# Altium project Digital_Watch.PrjPcb
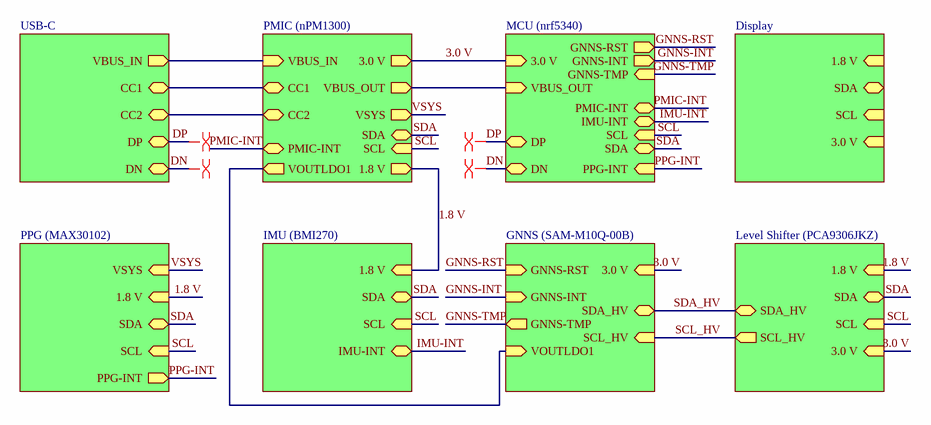
[diagram p0: Digital_Watch.SchDoc]
8 sheets, 72 parts. Net scope: hierarchical (ports join the sheet entries above them; power ports are global).
Board file: Digital_Watch.PcbDoc
Sheets:
  Digital_Watch.SchDoc
    Designator = MCU (nrf5340).SchDoc
    Designator = PMIC (nPM1300).SchDoc
    Designator = USB-C.SchDoc
    Designator = IMU (BMI270).SchDoc
    Designator = GNNS (SAM-M10Q-00B).SchDoc
    Designator = PPG (MAX30102).SchDoc
    Designator = Level Shifter (PCA9306JKZ).SchDoc

## Sheet Digital_Watch.SchDoc
size A4; Revision: 1.0; SheetNumber: 1; SheetTotal: 9; DocumentSize: A4; RefLayoutTitle: Digital Watch

### Sub-sheets
Designator = MCU (nrf5340): 3.0 V (in), DP (bidir), DN (bidir), VBUS_OUT (in), GNNS-RST (out), GNNS-INT (out), GNNS-TMP (in), PPG-INT (in), SDA (bidir), SCL (in), IMU-INT (bidir), PMIC-INT (bidir)
Designator = PMIC (nPM1300): 3.0 V (out), VBUS_IN (in), CC1 (bidir), CC2 (bidir), VBUS_OUT (out), VSYS (out), VOUTLDO1 (out), 1.8 V (out), SCL (in), SDA (bidir), PMIC-INT (bidir)
Designator = USB-C: DN (bidir), DP (bidir), CC2 (bidir), CC1 (bidir), VBUS_IN (out)
Designator = IMU (BMI270): 1.8 V (in), SDA (bidir), SCL (in), IMU-INT (bidir)
Designator = GNNS (SAM-M10Q-00B): 3.0 V (in), GNNS-RST (in), GNNS-INT (in), GNNS-TMP (out), VOUTLDO1 (in), SDA_HV (bidir), SCL_HV (in)
Designator = PPG (MAX30102): VSYS (in), SCL (in), 1.8 V (in), SDA (bidir), PPG-INT (out)
Designator = Level Shifter (PCA9306JKZ): 1.8 V (in), 3.0 V (in), SCL_HV (out), SDA_HV (bidir), SDA (bidir), SCL (in)
Designator = Display (file not in this document): 1.8 V (in), 3.0 V (in), SDA (bidir), SCL (in)

### Nets
1.8 V: sheet Designator/1.8 V, sheet Designator/1.8 V, sheet Designator/1.8 V, sheet Designator/1.8 V
3.0 V: sheet Designator/3.0 V, sheet Designator/3.0 V, sheet Designator/3.0 V, sheet Designator/3.0 V
CC1: sheet Designator/CC1, sheet Designator/CC1
CC2: sheet Designator/CC2, sheet Designator/CC2
DN: sheet Designator/DN, sheet Designator/DN  [project net D_N]
DP: sheet Designator/DP, sheet Designator/DP  [project net D_P]
GNNS-INT: sheet Designator/GNNS-INT, sheet Designator/GNNS-INT
GNNS-RST: sheet Designator/GNNS-RST, sheet Designator/GNNS-RST
GNNS-TMP: sheet Designator/GNNS-TMP, sheet Designator/GNNS-TMP
IMU-INT: sheet Designator/IMU-INT, sheet Designator/IMU-INT
PMIC-INT: sheet Designator/PMIC-INT, sheet Designator/PMIC-INT  [project net GPIO4]
PPG-INT: sheet Designator/PPG-INT, sheet Designator/PPG-INT  [project net P0.22]
SCL: sheet Designator/SCL, sheet Designator/SCL, sheet Designator/SCL, sheet Designator/SCL, sheet Designator/SCL  [project net P1.03/TWI]
SCL_HV: sheet Designator/SCL_HV, sheet Designator/SCL_HV
SDA: sheet Designator/SDA, sheet Designator/SDA, sheet Designator/SDA, sheet Designator/SDA, sheet Designator/SDA  [project net P1.02/TWI]
SDA_HV: sheet Designator/SDA_HV, sheet Designator/SDA_HV
VBUS_OUT: sheet Designator/VBUS_OUT, sheet Designator/VBUS_OUT
VOUTLDO1: sheet Designator/VOUTLDO1, sheet Designator/VOUTLDO1
VSYS: sheet Designator/VSYS, sheet Designator/VSYS
NetC001_1: sheet Designator/VBUS_IN, sheet Designator/VBUS_IN

### Layout directives
differential pair: D_N, D_P

### Notes on the sheet
- Title
- Size
- Date:
- A4
- Device
- Sheet         of
- Revision
- File:
- Drawn By:

## Sheet MCU (nrf5340).SchDoc
size A3; BoardTitle: nRF5340-QKAA Reference Layout - Config 1; DocumentNumber: 1; Revision: 1.2; SheetNumber: 3; SheetTotal: 9; DocumentSize: A3; RefLayoutTitle: Reference Layout Config. 1: VDDH supply, DCDC, USB; Device: nRF5340-QKAA; Classification: PUBLIC; ProjectName: Digital_Watch.PrjPcb
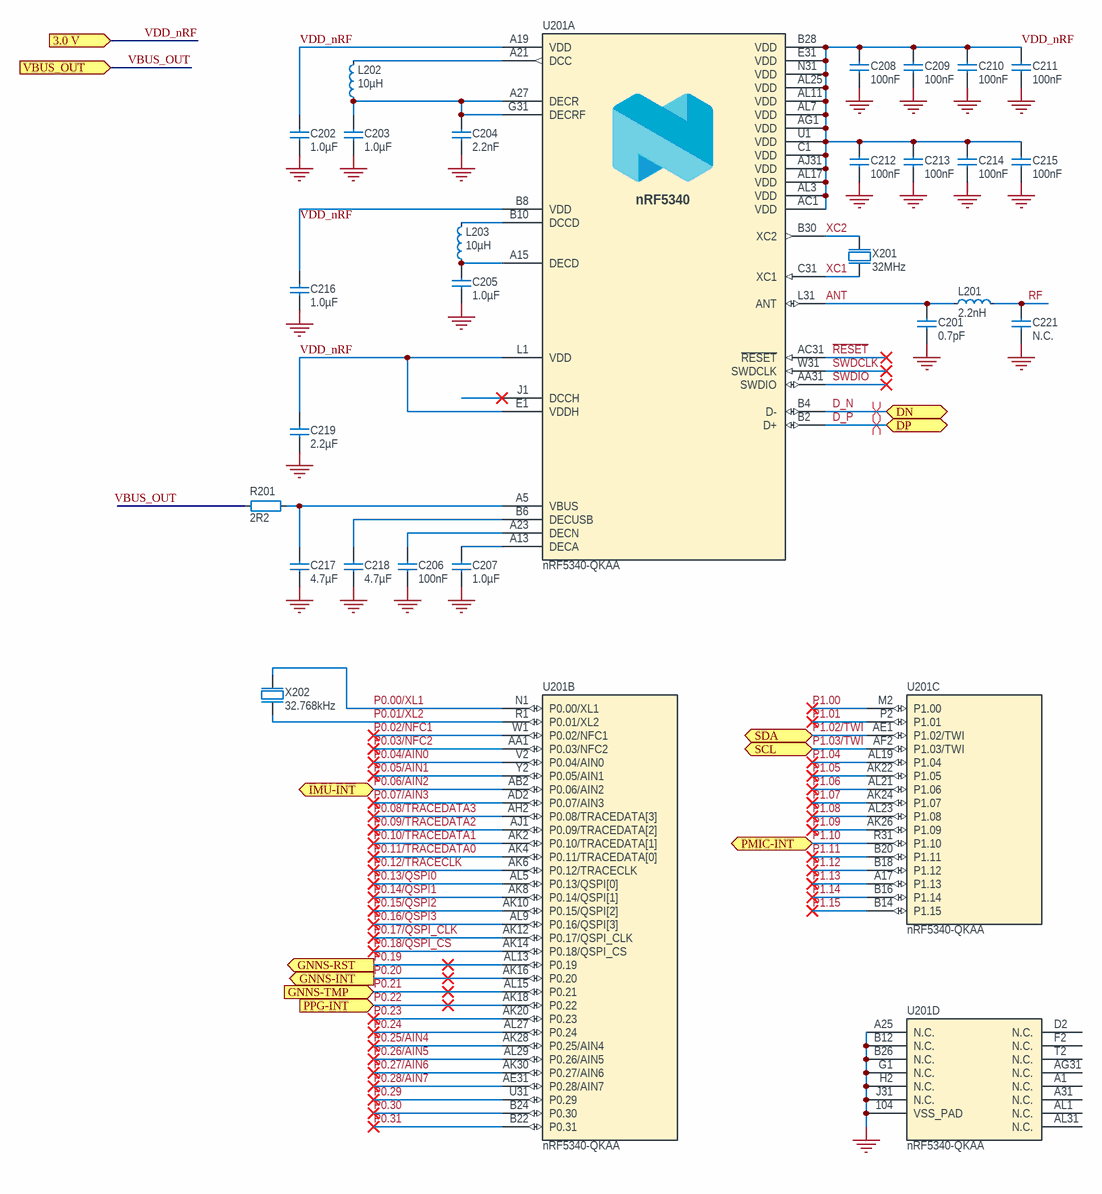
[diagram p1: MCU (nrf5340).SchDoc]

### Parts
C201  0.7pF  [CAPC0603X03L_C]
C202  1.0µF  [CAPC1005X04L]
C203  1.0µF  [CAPC1005X04L]
C204  2.2nF  [CAPC0603X03L_C]
C205  1.0µF  [CAPC1005X04L]
C206  100nF  [CAPC0603X03L_C]
C207  1.0µF  [CAPC1005X04L]
C208  100nF  [CAPC0603X03L_C]
C209  100nF  [CAPC0603X03L_C]
C210  100nF  [CAPC0603X03L_C]
C211  100nF  [CAPC0603X03L_C]
C212  100nF  [CAPC0603X03L_C]
C213  100nF  [CAPC0603X03L_C]
C214  100nF  [CAPC0603X03L_C]
C215  100nF  [CAPC0603X03L_C]
C216  1.0µF  [CAPC1005X04L]
C217  4.7µF  [CAPC1608X06L]
C218  4.7µF  [CAPC1608X06L]
C219  2.2µF  [CAPC1608X06L]
C221  N.C.  [CAPC0603X03L_C_NC]
L201  2.2nH  [INDC0603X03L_C]
L202  10µH  [INDC1608X06L]
L203  10µH  [INDC1608X06L]
R201  2R2  [RESC0603X03L_C]
U201  nRF5340-QKAA  [AQFN40P700X700X85_HS-99N]  (parts A,B,C,D of 4)
X201  32MHz  [BT-XTAL_2016]
X202  32.768kHz  [XTAL_2012]

### Ports
3.0 V (in, see Digital_Watch[2B], GNNS (SAM-M10Q-00B)[1A], Level Shifter (PCA9306JKZ)[2B], PMIC (nPM1300)[3B]), DN (bidir, see Digital_Watch[2B], USB-C[1B]), DP (bidir, see Digital_Watch[2B], USB-C[1B]), GNNS-INT (out, see Digital_Watch[3B], GNNS (SAM-M10Q-00B)[1A]), GNNS-RST (out, see Digital_Watch[3B], GNNS (SAM-M10Q-00B)[1A]), GNNS-TMP (in, see Digital_Watch[3B], GNNS (SAM-M10Q-00B)[1B]), IMU-INT (bidir, see Digital_Watch[3B], IMU (BMI270)[1B]), PMIC-INT (bidir, see Digital_Watch[3B], PMIC (nPM1300)[2B]), PPG-INT (in, see Digital_Watch[3B], PPG (MAX30102)[1A]), SCL (bidir, see Digital_Watch[3B], IMU (BMI270)[1A], Level Shifter (PCA9306JKZ)[2B], PMIC (nPM1300)[2C], PPG (MAX30102)[1A]), SDA (bidir, see Digital_Watch[3B], IMU (BMI270)[1B], Level Shifter (PCA9306JKZ)[2B], PMIC (nPM1300)[2C], PPG (MAX30102)[1A]), VBUS_OUT (in, see Digital_Watch[2B], PMIC (nPM1300)[4A])

### Nets
GND: C201.1 C202.2 C203.1 C204.2 C205.1 C206.2 C207.1 C208.2 C209.2 C210.2 C211.2 C212.2 C213.2 C214.2 C215.2 C216.1 C217.2 C218.2 C219.2 C221.1 U201.104(VSS_PAD) U201.A25(N.C.) U201.B12(N.C.) U201.B26(N.C.) U201.G1(N.C.) U201.H2(N.C.) U201.J31(N.C.) X201.2(GND) X201.4(GND)
ANT: C201.2 L201.2 U201.L31(ANT)
D_N: U201.B4(D-) ; port DN
D_P: U201.B2(D+) ; port DP
P0.00/XL1: U201.N1(P0.00/XL1) X202.1(inp)
P0.01/XL2: U201.R1(P0.01/XL2) X202.2(out)
P0.02/NFC1: U201.W1(P0.02/NFC1)
P0.03/NFC2: U201.AA1(P0.03/NFC2)
P0.04/AIN0: U201.V2(P0.04/AIN0)
P0.05/AIN1: U201.Y2(P0.05/AIN1)
P0.06/AIN2: U201.AB2(P0.06/AIN2) ; port IMU-INT  [project net IMU-INT]
P0.07/AIN3: U201.AD2(P0.07/AIN3)
P0.08/TRACEDATA3: U201.AH2(P0.08/TRACEDATA[3])
P0.09/TRACEDATA2: U201.AJ1(P0.09/TRACEDATA[2])
P0.10/TRACEDATA1: U201.AK2(P0.10/TRACEDATA[1])
P0.11/TRACEDATA0: U201.AK4(P0.11/TRACEDATA[0])
P0.12/TRACECLK: U201.AK6(P0.12/TRACECLK)
P0.13/QSPI0: U201.AL5(P0.13/QSPI[0])
P0.14/QSPI1: U201.AK8(P0.14/QSPI[1])
P0.15/QSPI2: U201.AK10(P0.15/QSPI[2])
P0.16/QSPI3: U201.AL9(P0.16/QSPI[3])
P0.17/QSPI_CLK: U201.AK12(P0.17/QSPI_CLK)
P0.18/QSPI_CS: U201.AK14(P0.18/QSPI_CS)
P0.19: U201.AL13(P0.19) ; port GNNS-RST  [project net GNNS-RST]
P0.20: U201.AK16(P0.20) ; port GNNS-INT  [project net GNNS-INT]
P0.21: U201.AL15(P0.21) ; port GNNS-TMP  [project net GNNS-TMP]
P0.22: U201.AK18(P0.22) ; port PPG-INT
P0.23: U201.AK20(P0.23)
P0.24: U201.AL27(P0.24)
P0.25/AIN4: U201.AK28(P0.25/AIN4)
P0.26/AIN5: U201.AL29(P0.26/AIN5)
P0.27/AIN6: U201.AK30(P0.27/AIN6)
P0.28/AIN7: U201.AE31(P0.28/AIN7)
P0.29: U201.U31(P0.29)
P0.30: U201.B24(P0.30)
P0.31: U201.B22(P0.31)
P1.00: U201.M2(P1.00)
P1.01: U201.P2(P1.01)
P1.02/TWI: U201.AE1(P1.02/TWI) ; port SDA
P1.03/TWI: U201.AF2(P1.03/TWI) ; port SCL
P1.04: U201.AL19(P1.04)
P1.05: U201.AK22(P1.05)
P1.06: U201.AL21(P1.06)
P1.07: U201.AK24(P1.07)
P1.08: U201.AL23(P1.08)
P1.09: U201.AK26(P1.09)
P1.10: U201.R31(P1.10) ; port PMIC-INT  [project net GPIO4]
P1.11: U201.B20(P1.11)
P1.12: U201.B18(P1.12)
P1.13: U201.A17(P1.13)
P1.14: U201.B16(P1.14)
P1.15: U201.B14(P1.15)
~{RESET}: U201.AC31(~{RESET})
RF: C221.2 L201.1
SWDCLK: U201.W31(SWDCLK)
SWDIO: U201.AA31(SWDIO)
VBUS_OUT: R201.1 ; port VBUS_OUT
VDD_nRF: C202.1 C208.1 C209.1 C210.1 C211.1 C212.1 C213.1 C214.1 C215.1 C216.2 C219.1 U201.A19(VDD) U201.AC1(VDD) U201.AG1(VDD) U201.AJ31(VDD) U201.AL3(VDD) U201.AL7(VDD) U201.AL11(VDD) U201.AL17(VDD) U201.AL25(VDD) U201.B8(VDD) U201.B28(VDD) U201.C1(VDD) U201.E1(VDDH) U201.E31(VDD) U201.L1(VDD) U201.N31(VDD) U201.U1(VDD) ; port 3.0 V  [project net 3.0 V]
XC1: U201.C31(XC1) X201.1(inp)
XC2: U201.B30(XC2) X201.3(out)
NetC203_2: C203.2 C204.1 L202.1 U201.A27(DECR) U201.G31(DECRF)
NetC205_2: C205.2 L203.1 U201.A15(DECD)
NetC206_1: C206.1 U201.A23(DECN)
NetC207_2: C207.2 U201.A13(DECA)
NetC217_1: C217.1 R201.2 U201.A5(VBUS)
NetC218_1: C218.1 U201.B6(DECUSB)
NetL202_2: L202.2 U201.A21(DCC)
NetL203_2: L203.2 U201.B10(DCCD)

Not connected (* = marked no-connect by the designer): U201 A1(N.C.) A31(N.C.) AG31(N.C.) AL1(N.C.) AL31(N.C.) D2(N.C.) F2(N.C.) J1(DCCH)* T2(N.C.)

### Layout directives
differential pair: D_N, D_P

### Notes on the sheet
- Title
- Size
- Date:
- File:
- A3
- Device
- Sheet         of
- Drawn By:
- Revision
- Classification:
- (in symbol nRF5340-QKAA, part A) nRF5340

### Library data of the parts
C201 = C0201-0.7p: Capacitor, NP0, ±0.05pF; Pad Count: 2; Value: 0.7pF; Footprint Doc: 0201; Component Class: Capacitors
C202 C203 C205 C207 C216 = C0402-1µ0-10V-X7S-GRM155C71A105KE11: Capacitor, X7S, ±10%; Pad Count: 2; Value: 1.0µF; Footprint Doc: 0402; Component Class: Capacitors
  C202: Author: prbu
C204 = C0201-2n2: Capacitor, X7R, ±10%; Pad Count: 2; Value: 2.2nF; Footprint Doc: 0201; Component Class: Capacitors
C206 C208-C215 = C0201-100n-16V-X7S: Capacitor, X7S, ±10%; Pad Count: 2; Value: 100nF; Footprint Doc: 0201; Component Class: Capacitors
C217 = C0603-4µ7-10V-X7S: Capacitor, X7S, ±10%; Pad Count: 2; Value: 4.7µF; Footprint Doc: 0603; Component Class: Capacitors
C218 = C0603-4µ7-6.3V-X7R: Capacitor, X7R, ±10%; Pad Count: 2; Value: 4.7µF; Footprint Doc: 0603; Component Class: Capacitors
C219 = C0603-2µ2-6.3V-X7R: Capacitor, X7R, ±10%; Pad Count: 2; Value: 2.2µF; Footprint Doc: 0603; Component Class: Capacitors
C221 = C0201-N.C.: Not mounted; Assembly: Not mounted; Pad Count: 2; Value: N.C.; Footprint Doc: 0201; Component Class: Capacitors
L201 = L0201-2n2: High frequency chip inductor, ±5%; Pad Count: 2; Footprint Doc: 0201; Value: 2.2nH; Component Class: Inductors
L202 L203 = L0603-10µ: Chip Inductor, IDC,min = 50 mA, ±20%; Pad Count: 2; Value: 10µH; Footprint Doc: 0603; Component Class: Inductors
R201 = R0201: Resistor, ±1%, 0.05W; Pad Count: 2; Footprint Doc: 0201; Value: 2R2; Component Class: Resistors; Author: rsk
U201 = nRF5340-QKAA: Multi-protocol Bluetooth Low Energy, IEEE 802.15.4, ANT and 2.4GHz proprietary system-on-chip; Pad Count: 98; Footprint Doc: AQFN-98; Value: nRF5340-QKAA; Component Class: nRF_Devices
X201 = XTAL_SMD2016_32MHz_8pF_General: XTAL SMD 2016, 32MHz, Cl=8pF, Total Tol: ±30ppm; Pad Count: 4; Value: 32MHz; Footprint Doc: XTAL_2016; Component Class: Oscillators
X202 = XTAL_SMD2012_32.768kHz_9pF_General: XTAL SMD 2012, 32.768kHz, Cl=9pF, Total Tol: ±50ppm; Pad Count: 2; Value: 32.768kHz; Footprint Doc: XTAL_2012; Component Class: Oscillators

## Sheet PMIC (nPM1300).SchDoc: nPM1300-QEAA Ref. Layout Config. 1
size A4; Revision: 1.2; SheetNumber: 2; SheetTotal: 9; DocumentSize: A4; BoardTitle: nPM1300-QEAA Ref. Layout Config. 1; PCAName: nPM1300-QEAA; RefLayoutTitle: PMIC; Device: nPM1300-QEAA; Config: 1
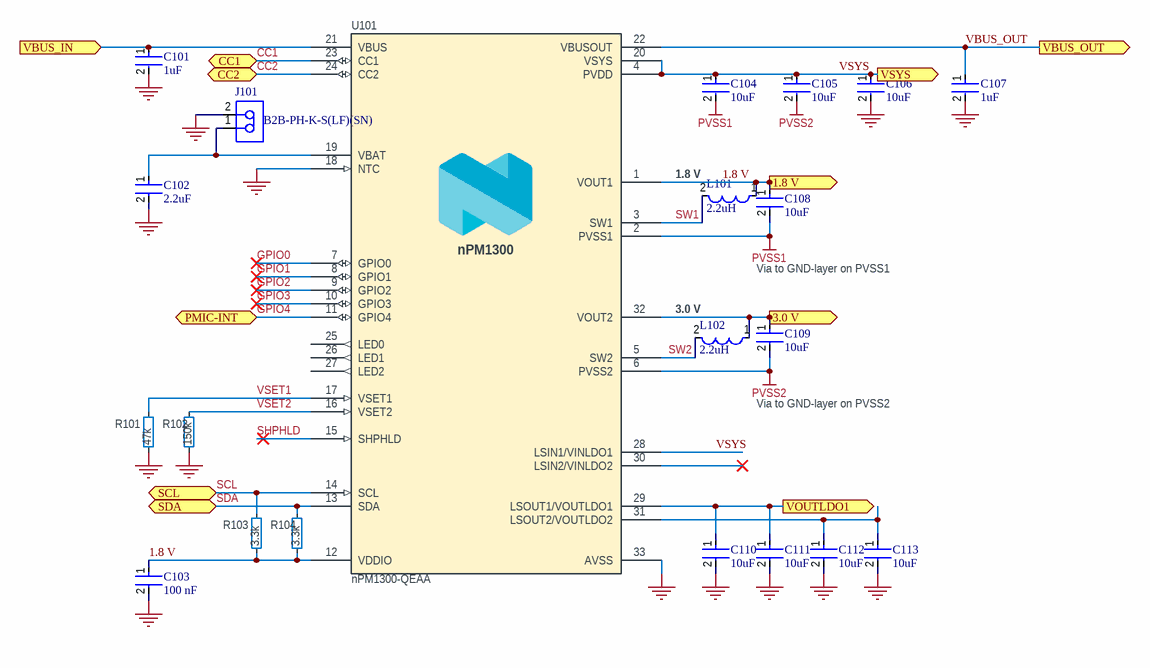
[diagram p2: PMIC (nPM1300).SchDoc]

### Parts
C101  1uF  [FP-CL10-IPC_C]
C102  2.2uF  [FP-GRM188-0_2-MFG]
C103  100 nF  [FP-CC0201-BA-MFG]
C104  10uF  [FP-GRM188-0_2-MFG]
C105  10uF  [FP-GRM188-0_2-MFG]
C106  10uF  [FP-GRM188-0_2-MFG]
C107  1uF  [FP-CL10-IPC_C]
C108  10uF  [FP-GRM188-0_2-MFG]
C109  10uF  [FP-GRM188-0_2-MFG]
C110  10uF  [FP-GRM188-0_2-MFG]
C111  10uF  [FP-GRM188-0_2-MFG]
C112  10uF  [FP-GRM188-0_2-MFG]
C113  10uF  [FP-GRM188-0_2-MFG]
J101  B2B-PH-K-S(LF)(SN)  [JST-B2B-PH-K-S_V]
L101  2.2uH  [FP-MLP2016M-IPC_B]
L102  2.2uH  [FP-MLP2016M-IPC_B]
R101  47k  [RESC0603X03L_C]
R102  150k  [RESC0603X03L_C]
R103  3.3k  [RESC0603X03L_C]
R104  3.3k  [RESC0603X03L_C]
U101  nPM1300-QEAA  [QFN32_5X5_NOR]

### Ports
1.8 V (out, see Digital_Watch[2B], IMU (BMI270)[1A], Level Shifter (PCA9306JKZ)[2B], PPG (MAX30102)[1A]), 3.0 V (out, see Digital_Watch[2B], GNNS (SAM-M10Q-00B)[1A], Level Shifter (PCA9306JKZ)[2B], MCU (nrf5340)[2A]), CC1 (bidir, see Digital_Watch[2B], USB-C[4B]), CC2 (bidir, see Digital_Watch[2B], USB-C[4B]), PMIC-INT (bidir, see Digital_Watch[2B], MCU (nrf5340)[4C]), SCL (bidir, see Digital_Watch[2B], IMU (BMI270)[1A], Level Shifter (PCA9306JKZ)[2B], MCU (nrf5340)[4C], PPG (MAX30102)[1A]), SDA (bidir, see Digital_Watch[2B], IMU (BMI270)[1B], Level Shifter (PCA9306JKZ)[2B], MCU (nrf5340)[4C], PPG (MAX30102)[1A]), VBUS_IN (in, see Digital_Watch[2B], USB-C[2B]), VBUS_OUT (out, see Digital_Watch[2B], MCU (nrf5340)[2A]), VOUTLDO1 (out, see Digital_Watch[2B], GNNS (SAM-M10Q-00B)[1B]), VSYS (out, see Digital_Watch[2B], PPG (MAX30102)[1B])

### Nets
GND: C101.2 C102.2 C103.2 C106.2 C107.2 C110.2 C111.2 C112.2 C113.2 J101.2 R101.2 R102.2 U101.18(NTC) U101.33(AVSS)
PVSS1: C104.2 C108.2 U101.2(PVSS1)
PVSS2: C105.2 C109.2 U101.6(PVSS2)
1.8 V: C103.1 C108.1 L101.1 R103.2 R104.2 U101.1(VOUT1) U101.12(VDDIO) ; port 1.8 V
3.0 V: C109.1 L102.1 U101.32(VOUT2) ; port 3.0 V
CC1: U101.23(CC1) ; port CC1
CC2: U101.24(CC2) ; port CC2
GPIO0: U101.7(GPIO0)
GPIO1: U101.8(GPIO1)
GPIO2: U101.9(GPIO2)
GPIO3: U101.10(GPIO3)
GPIO4: U101.11(GPIO4) ; port PMIC-INT
SCL: R103.1 U101.14(SCL) ; port SCL  [project net P1.03/TWI]
SDA: R104.1 U101.13(SDA) ; port SDA  [project net P1.02/TWI]
SHPHLD: U101.15(SHPHLD)
SW1: L101.2 U101.3(SW1)
SW2: L102.2 U101.5(SW2)
VBUS_OUT: C107.1 U101.22(VBUSOUT) ; port VBUS_OUT
VOUTLDO1: C110.1 C111.1 U101.29(LSOUT1/VOUTLDO1) ; port VOUTLDO1
VSET1: R101.1 U101.17(VSET1)
VSET2: R102.1 U101.16(VSET2)
VSYS: C104.1 C105.1 C106.1 U101.4(PVDD) U101.20(VSYS) U101.28(LSIN1/VINLDO1) ; port VSYS
NetC001_1: C101.1 U101.21(VBUS) ; port VBUS_IN
NetC102_1: C102.1 J101.1 U101.19(VBAT)
NetC112_1: C112.1 C113.1 U101.31(LSOUT2/VOUTLDO2)

Not connected (* = marked no-connect by the designer): U101 25(LED0) 26(LED1) 27(LED2) 30(LSIN2/VINLDO2)*

### Notes on the sheet
- (near L101) 1.8 V
- (near L102) 3.0 V
- Via to GND-layer on PVSS1
- Via to GND-layer on PVSS2
- Title
- Size
- Date:
- File:
- A4
- Config. No.
- Device
- Sheet
- Drawn By:
- Revision
- of
- Nordic Semiconductor does not warrant the accuracy or completeness of this documentation or any included information. Nordic Semiconductor makes no assurances that this design will meet specification, be appropriate for your application, or fit for any particular purpose, or that it will function in an implementation. Nordic Semiconductor also does not claim that the design is ready for production. It is your responsibility to thoroughly validate and test your design implementation to confirm the functionality of your application.
  © Nordic Semiconductor — All rights reserved.
- Classification:
- (in symbol nPM1300_QEAA) nPM1300

### Library data of the parts
C101 C107 = CMP-13271-002233-1: Cap Ceramic 1uF 10V X5R ±10% Pad SMD 0603 +85°C T/R; Radiation Hardening: No; Height: 0.8mm; Dielectric: X5R; Capacitance: 1uF; Mount: Surface Mount; Length: 1.6mm; Package Quantity: 10000; Tolerance: 10%; Voltage: 10V; Thickness: 0.035inch; Packaging: Tape and Reel; Lead Free: Lead Free; Voltage Rating (DC): 10V; Width: 0.031inch; Voltage Rating: 10V; Case/Package: 0603; Min Operating Temperature: -55°C; Max Operating Temperature: 85°C; Depth: 0.8mm
C102 = CMP-06035-057307-1: Chip Multilayer Ceramic Capacitors for General Purpose, 0603, 2.2uF, X7R, 15%, 10%, 16V; Case/Package: 0603
C103 = CMP-03422-001239-1: CAP CER 0.1UF 16V X5R 0201; Manufacturer Part Number: CC0201KRX5R7BB104; Manufacturer: Yageo; Material: Ceramic; Temperature Coefficient: 15%; Tolerance: 0.1; Value: 100 nF; Capacitance: 100 nF; Temperature Range Low: -55°C; Footprint Url: http://www.yageo.com/exep/pages/download/literatures/UPY-C_GEN_24.pdf; Automotive: No; Temperature Characteristic: X5R; Digikey Description: CAP CER 0.1UF 16V X5R 0201; Temperature: -55°C to +85°C; RoHS: TRUE; Mouser Description: Multilayer Ceramic Capacitors MLCC - SMD/SMT 100K nF X5R 10% 16 Volts; Height: 0.33mm; Category: Cap; ComponentLink2Description: Datasheet; Lead Free: Yes; Ipc Land Pattern Name: CAPC6030X30; Device Class L2: Capacitors; Temperature Range High: +85°C; Octopart: https://octopart.com/cc0201krx5r7bb104-yageo-57080722; Device Class L3: Ceramic Capacitors; Device Class L1: Passive Components; Package: CC0201-BA; ComponentLink2URL: http://www.yageo.com/documents/recent/UPY-GPHC_X5R_4V-to-50V_25.pdf; Voltage Rating: 16 V
C104-C106 C108-C113 = CMP-2006-02520-2: Chip Multilayer Ceramic Capacitors for General Purpose, 0603, 10uF, X5R, 15%, 20%, 25V; Tolerance: 20%; Resistor Type: Ceramic; Voltage: 25V; Max Operating Temperature: 85°C; Min Operating Temperature: -55°C; Capacitance: 10uF; Dielectric: X5R; Lead Free: Lead Free; REACH SVHC: No SVHC; Case/Package: 0603; Mount: Surface Mount; Voltage Rating (DC): 25V; Height: 0.8mm; Length: 1.6mm; Thickness: 0.031inch; Width: 0.031inch; Termination: SMD/SMT; Case Code (Imperial): 0603; Case Code (Metric): 1608; Package Quantity: 1; Packaging: Tape and Reel; Depth: 0.8mm; Voltage Rating: 25V; Weight: 0.000222oz; Number of Pins: 2
J101 = CMP-2000-05162-1: Male Header, Pitch 2 mm, 1 x 2 Position, Height 6 mm, Tail Length 3.4 mm, -25 to 85 degC, RoHS, Bulk; Manufacturer: JST; Pitch: 2mm; Style/Orientation: StraightHeader/Plug; No of Positions: 2; Datasheet Version: Nov-08; Datasheet URL: http://datasheet.octopart.com/B2B-PH-K-S%28LF%29%28SN%29-JST-datasheet-8324864.pdf; Manufacturer URL: http://www.jst.com/home2.html; Type: ShroudedHeader; Termination: Crimp
L101 L102 = CMP-08253-000356-1: Shielded Multilayer Inductor 2.2uH ±20% 1200mA 143mΩ SMD 0806; DC Resistance (DCR): 143mR; Test Frequency: 2MHz; Current Rating: 1.2A; Core Material: Ferrite; Inductance: 2.2uH; Shielding: Shielded; Case Code (Imperial): 0806; Tolerance: 20%; Max Operating Temperature: 125°C; Case Code (Metric): 2016; Length: 0.079inch; RoHS Compliant: Yes; Case/Package: 0806; Packaging: Tape and Reel; Mount: Surface Mount; Width: 0.063inch; Package Quantity: 3000; Min Operating Temperature: -40°C; Height - Seated (Max): 0.039inch
R101-R104 = R0201: Resistor, ±1%, 0.05W; Pad Count: 2; Component Class: Resistors; Author: rsk; Footprint Doc: 0201
  R101: Value: 47k
  R102: Value: 150k
  R103 R104: Value: 3.3k
U101 = nPM1300_QEAA: Li-Ion/Li-Polymer USB-C battery charger with high efficiency buck regulators, LDOs or load switches, LED drivers, TWI and VBUSOUT; Manufacturer: Nordic Semiconductor; Part number NEMS: 102000291; Component Status: Active; Pad Count: 33; Note: N.A.; Part Number: nPM1300-QEAA; PartId: 102000291; Component Class: Nordic_Devices; Author: eisk; Manufacturer Part Number: nPM1300-QEAA; ComponentLink1URL: N.A.; ComponentLink1Description: Datasheet; ComponentLink2URL: N.A.; ComponentLink2Description: Supplier link; HelpURL: N.A.; LatestRevisionDate: 2023-05-25; Published: 2022-02-17; Footprint Doc: QFN-32; Value: nPM1300-QEAA; Supplier 1: Nordic Semiconductor; Supplier Part Number 1: nPM1300-QEAA; Supplier 2: N.A.; Supplier Part Number 2: N.A.; Artikkelnr Noca: N.A.; Part number IPS: N.A.; Part number Norautron: N.A.

## Sheet USB-C.SchDoc
size A; SheetNumber: 4; SheetTotal: 9
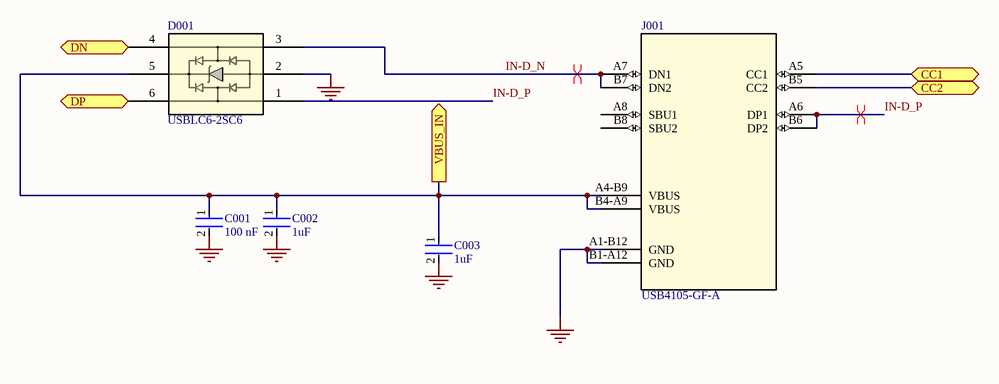
[diagram p3: USB-C.SchDoc]

### Parts
C001  100 nF  [FP-CC0201-BA-MFG]
C002  1uF  [FP-CL10-IPC_C]
C003  1uF  [FP-CL10-IPC_C]
D001  USBLC6-2SC6  [SOT23-6L_STM]
J001  USB4105-GF-A  [USB4105_GCT]

### Ports
CC1 (bidir, see Digital_Watch[1B], PMIC (nPM1300)[2A]), CC2 (bidir, see Digital_Watch[1B], PMIC (nPM1300)[2B]), DN (bidir, see Digital_Watch[1B], MCU (nrf5340)[5B]), DP (bidir, see Digital_Watch[1B], MCU (nrf5340)[5B]), VBUS_IN (out, see Digital_Watch[1B], PMIC (nPM1300)[1A])

### Nets
GND: C001.2 C002.2 C003.2 D001.2 J001.A1-B12(GND) J001.B1-A12(GND)
CC1: J001.A5(CC1) ; port CC1
CC2: J001.B5(CC2) ; port CC2
D_N: D001.4 ; port DN
D_P: D001.6 ; port DP
IN-D_N: D001.3 J001.A7(DN1) J001.B7(DN2)
IN-D_P: D001.1 J001.A6(DP1) J001.B6(DP2)
NetC001_1: C001.1 C002.1 C003.1 D001.5 J001.A4-B9(VBUS) J001.B4-A9(VBUS) ; port VBUS_IN

Not connected (* = marked no-connect by the designer): J001 A8(SBU1) B8(SBU2)

### Layout directives
differential pair: IN-D_N, IN-D_P

### Library data of the parts
C001 = CMP-03422-001239-1: as C103 on sheet PMIC (nPM1300); Value: 100 nF; Capacitance: 100 nF; Temperature Range Low: -55°C; Footprint Url: http://www.yageo.com/exep/pages/download/literatures/UPY-C_GEN_24.pdf; Automotive: No; Temperature Characteristic: X5R; Digikey Description: CAP CER 0.1UF 16V X5R 0201; Temperature: -55°C to +85°C; RoHS: TRUE; Mouser Description: Multilayer Ceramic Capacitors MLCC - SMD/SMT 100K nF X5R 10% 16 Volts; Height: 0.33mm; Category: Cap; ComponentLink2Description: Datasheet; Lead Free: Yes; Ipc Land Pattern Name: CAPC6030X30; Device Class L2: Capacitors; Temperature Range High: +85°C; Octopart: https://octopart.com/cc0201krx5r7bb104-yageo-57080722; Device Class L3: Ceramic Capacitors; Device Class L1: Passive Components; Package: CC0201-BA; ComponentLink2URL: http://www.yageo.com/documents/recent/UPY-GPHC_X5R_4V-to-50V_25.pdf; Voltage Rating: 16 V
C002 C003 = CMP-13271-002233-1: as C101 on sheet PMIC (nPM1300); Radiation Hardening: No; Height: 0.8mm; Dielectric: X5R; Capacitance: 1uF; Mount: Surface Mount; Length: 1.6mm; Package Quantity: 10000; Tolerance: 10%; Voltage: 10V; Thickness: 0.035inch; Packaging: Tape and Reel; Lead Free: Lead Free; Voltage Rating (DC): 10V; Width: 0.031inch; Voltage Rating: 10V; Case/Package: 0603; Min Operating Temperature: -55°C; Max Operating Temperature: 85°C; Depth: 0.8mm
D001 = USBLC6-2SC6: 5A 17V 6V Unidirectional 5.25V SOT-23-6 ESD and Surge Protection (TVS/ESD) ROHS; Manufacturer: STMicroelectronics; Value: 2.5pF; Data Rate: 480Mbps; Element Configuration: Dual; ESD Protection: Yes; Forward Voltage: 1.1V; Leakage Current: 150nA; Max Junction Temperature (Tj): 125°C; Number of Bidirectional Channels: 2; Number of Elements: 1; Reverse Standoff Voltage: 5V; Test Current: 1mA; Supplier: Future Electronics; Supplier Part Number: USBLC6-2SC6; Manufacturer Part Number: USBLC6-2SC6; RoHS: Compliant; Category: TVS Diodes; Stock: 120000; Pricing: 3000=0.0806, 6000=0.0793, 12000=0.078, 15000=0.0776, 45000=0.075 (USD); Breakdown Voltage: 6V; Case/Package: SOT-23; China RoHS: Compliant; Clamping Voltage: 17V; Contact Plating: Tin; Country of Origin: Mainland China; Depth: 1.75mm; Direction: Unidirectional; Export Control Classification Number (ECCN) Code: EAR99; Height: 1.45mm; Harmonized Tariff Schedule (HTS) Code: 8541.10.00.50; Introduction Date: 2005-03-15; Lead Free: Lead Free; Length: 3.05mm; Lifecycle Status: Production; Max Breakdown Voltage: 6V; Max Operating Temperature: 125°C; Max Repetitive Reverse Voltage (Vrrm): 5.25V; Max Reverse Leakage Current: 150nA; Min Breakdown Voltage: 6V; Min Operating Temperature: -40°C; Mounting Technology: Surface Mount; Number of Channels: 2; Pins: 6; Number of Terminals: 6; Operating Supply Voltage: 1.1V; Peak Pulse Current: 5A; Peak Reverse Current: 150nA; Polarity: Unidirectional; Power Line Protection: Yes; Radiation Hardening: No; REACH SVHC: Yes; Reverse Breakdown Voltage: 6V; Schedule B: 8536300000, 8536300000|8536300000|8536300000|8536300000|8536300000|8536300000|8536300000|8536300000|8536300000|8536300000|8536300000|8536300000|8536300000|8536300000|8536300000|8536300000|8536300000|8536300000|8536300000|8536300000|8536300000|8536300000|8536300000|85; Termination: SMD/SMT; Width: 1.75mm; Working Voltage: 5V; ComponentLink1URL: https://datasheet.octopart.com:443/USBLC6-2SC6-STMicroelectronics-datasheet-10412581.pdf?src-supplier=Newark; ComponentLink1Description: https://datasheet.octopart.com:443/USBLC6-2SC6-STMicroelectronics-datasheet-10412581.pdf?src-supplier=Newark; ComponentLink2URL: https://datasheet.octopart.com:443/USBLC6-2SC6-STMicroelectronics-datasheet-181961833.pdf?src-supplier=Newark; ComponentLink2Description: https://datasheet.octopart.com:443/USBLC6-2SC6-STMicroelectronics-datasheet-181961833.pdf?src-supplier=Newark; ComponentLink3URL: https://datasheet.octopart.com:443/USBLC6-2SC6-STMicroelectronics-datasheet-525477.pdf?src-supplier=Factory+Futures; ComponentLink3Description: https://datasheet.octopart.com:443/USBLC6-2SC6-STMicroelectronics-datasheet-525477.pdf?src-supplier=Factory+Futures; ComponentLink4URL: https://datasheet.octopart.com:443/USBLC6-2SC6-STMicroelectronics-datasheet-82998616.pdf?src-supplier=Farnell; ComponentLink4Description: https://datasheet.octopart.com:443/USBLC6-2SC6-STMicroelectronics-datasheet-82998616.pdf?src-supplier=Farnell; ComponentLink5URL: https://datasheet.octopart.com:443/USBLC6-2SC6-STMicroelectronics-datasheet-46285.pdf?src-supplier=Farnell; ComponentLink5Description: https://datasheet.octopart.com:443/USBLC6-2SC6-STMicroelectronics-datasheet-46285.pdf?src-supplier=Farnell; ComponentLink6URL: https://datasheet.octopart.com:443/USBLC6-2SC6-STMicroelectronics-datasheet-14050643.pdf?src-supplier=iiiC; ComponentLink6Description: https://datasheet.octopart.com:443/USBLC6-2SC6-STMicroelectronics-datasheet-14050643.pdf?src-supplier=iiiC; ComponentLink7URL: https://datasheet.octopart.com:443/USBLC6-2SC6-STMicroelectronics-datasheet-10521292.pdf?src-supplier=Jameco; ComponentLink7Description: https://datasheet.octopart.com:443/USBLC6-2SC6-STMicroelectronics-datasheet-10521292.pdf?src-supplier=Jameco
J001 = USB4105-GF-A: USB Connector, 24 Contact(s), Female, Right Angle, Solder Terminal, Locking, Receptacle; Manufacturer: Global Connector Technology; Contact Resistance: 50mΩ; Current Rating: 6.25A; Dielectric Material: Liquid Crystal Polymer; Insulation Resistance: 100MΩ; Number of Contacts: 16; Number of Ports: 1; Number of Positions: 24; USB Standard: USB 2.0; Voltage Rating: 20V; Supplier: DigiKey; Supplier Part Number: 2073-USB4105-GF-ACT-ND; Manufacturer Part Number: USB4105-GF-A; RoHS: Compliant; Category: USB Connectors; Stock: 151521; Pricing: 1=0.8, 10=0.676, 25=0.6336, 50=0.6034, 100=0.5745, 250=0.53848, 800=0.49603, 1600=0.47234, 2400=0.45903, 4000=0.44278, 5600=0.43239, 8000=0.42165 (USD); China RoHS: Compliant; Contact Material: Gold, Nickel; Country of Origin: Mainland China; Export Control Classification Number (ECCN) Code: EAR99; Gender: Female; Height: 3.46mm; Harmonized Tariff Schedule (HTS) Code: 8536.69.40.30; Insulation Color: Black; Introduction Date: 2021-04-29; Lifecycle Status: Production; Max Operating Temperature: 85°C; Min Operating Temperature: -40°C; Pins: 16; Number of Rows: 1; Orientation: Right Angle; REACH SVHC: Yes; Shell Finish: Nickel; Shell Material: Stainless Steel; Terminal Pitch: 500µm; ComponentLink1URL: https://datasheet.octopart.com:443/USB4105-GF-A-GCT-datasheet-166929323.pdf?src-supplier=SOS+electronic; ComponentLink1Description: https://datasheet.octopart.com:443/USB4105-GF-A-GCT-datasheet-166929323.pdf?src-supplier=SOS+electronic; ComponentLink2URL: https://datasheet.octopart.com:443/USB4105-GF-A-GCT-datasheet-188935996.pdf?src-supplier=TME; ComponentLink2Description: https://datasheet.octopart.com:443/USB4105-GF-A-GCT-datasheet-188935996.pdf?src-supplier=TME; ComponentLink3URL: https://datasheet.octopart.com:443/USB4105-GF-A-GCT-datasheet-188869076.pdf?src-supplier=TME; ComponentLink3Description: https://datasheet.octopart.com:443/USB4105-GF-A-GCT-datasheet-188869076.pdf?src-supplier=TME; ComponentLink4URL: https://datasheet.octopart.com:443/USB4105-GF-A-GCT-datasheet-166927665.pdf?src-supplier=TME; ComponentLink4Description: https://datasheet.octopart.com:443/USB4105-GF-A-GCT-datasheet-166927665.pdf?src-supplier=TME; Supplier 1: DigiKey; Supplier Part Number 1: 2073-USB4105-GF-ACT-ND

## Sheet IMU (BMI270).SchDoc
size A; SheetNumber: 5; SheetTotal: 9
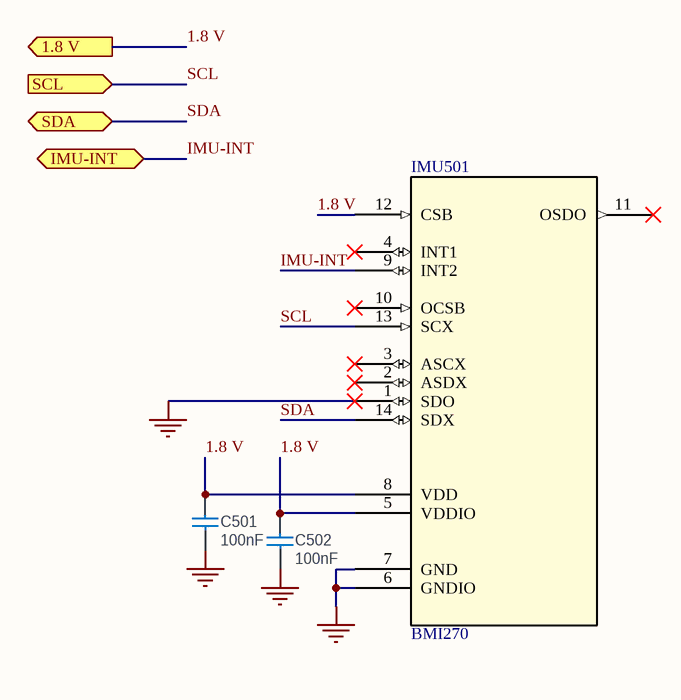
[diagram p4: IMU (BMI270).SchDoc]

### Parts
C501  100nF  [CAPC0603X03L_C]
C502  100nF  [CAPC0603X03L_C]
IMU501  BMI270  [BMI270_BOS]

### Ports
1.8 V (out, see Digital_Watch[2C], Level Shifter (PCA9306JKZ)[2B], PMIC (nPM1300)[3B], PPG (MAX30102)[1A]), IMU-INT (bidir, see Digital_Watch[2C]), SCL (in, see Digital_Watch[2C], Level Shifter (PCA9306JKZ)[2B], MCU (nrf5340)[4C], PMIC (nPM1300)[2C], PPG (MAX30102)[1A]), SDA (bidir, see Digital_Watch[2C], Level Shifter (PCA9306JKZ)[2B], MCU (nrf5340)[4C], PMIC (nPM1300)[2C], PPG (MAX30102)[1A])

### Nets
GND: C501.1 C502.1 IMU501.1(SDO) IMU501.6(GNDIO) IMU501.7(GND)
1.8 V: C501.2 C502.2 IMU501.5(VDDIO) IMU501.8(VDD) IMU501.12(CSB) ; port 1.8 V
IMU-INT: IMU501.9(INT2) ; port IMU-INT
SCL: IMU501.13(SCX) ; port SCL  [project net P1.03/TWI]
SDA: IMU501.14(SDX) ; port SDA  [project net P1.02/TWI]

Not connected (* = marked no-connect by the designer): IMU501 2(ASDX)* 3(ASCX)* 4(INT1)* 10(OCSB)* 11(OSDO)*

### Library data of the parts
C501 C502 = C0201-100n-16V-X7S: Capacitor, X7S, ±10%; Pad Count: 2; Value: 100nF; Footprint Doc: 0201; Component Class: Capacitors; Author: rsk
IMU501 = BMI270: Inertial Measurement Unit Digital Output 1.8V/2.5V/3.3V Automotive 14-Pin LGA; Manufacturer: Bosch Tools; Supplier: DigiKey; Supplier Part Number: 828-1091-1-ND; Manufacturer Part Number: BMI270; RoHS: Compliant; Category: Sensors; Stock: 35722; Pricing: 1=4.23, 5=3.788, 10=3.624, 25=3.428, 50=3.2942, 100=3.1715, 500=2.92464, 1000=2.8327 (USD); Export Control Classification Number (ECCN) Code: EAR99; Introduction Date: 2019-05-31; Lifecycle Status: Production; REACH SVHC: Yes; ComponentLink1URL: https://datasheet.octopart.com:443/BMI270-Bosch-Tools-datasheet-181206537.pdf?src-supplier=IHS; ComponentLink1Description: https://datasheet.octopart.com:443/BMI270-Bosch-Tools-datasheet-181206537.pdf?src-supplier=IHS; ComponentLink2URL: https://datasheet.octopart.com:443/BMI270-Bosch-Tools-datasheet-136061757.pdf?src-supplier=Future+Electronics; ComponentLink2Description: https://datasheet.octopart.com:443/BMI270-Bosch-Tools-datasheet-136061757.pdf?src-supplier=Future+Electronics; Supplier 1: DigiKey; Supplier Part Number 1: 828-1091-1-ND

## Sheet GNNS (SAM-M10Q-00B).SchDoc
size A; SheetNumber: 6; SheetTotal: 9
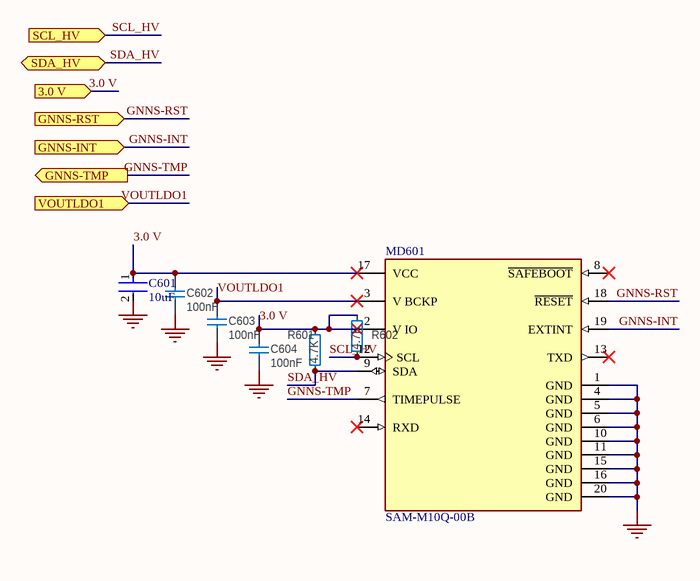
[diagram p5: GNNS (SAM-M10Q-00B).SchDoc]

### Parts
C601  10uF  [FP-GRM188-0_2-MFG]
C602  100nF  [CAPC0603X03L_C]
C603  100nF  [CAPC0603X03L_C]
C604  100nF  [CAPC0603X03L_C]
MD601  SAM-M10Q-00B  [FP-SAM-M10Q-00B-MFG]
R601  4.7K  [RESC0603X03L_C]
R602  4.7K  [RESC0603X03L_C]

### Ports
3.0 V (in, see Digital_Watch[3C], Level Shifter (PCA9306JKZ)[2B], MCU (nrf5340)[2A], PMIC (nPM1300)[3B]), GNNS-INT (in, see Digital_Watch[2C], MCU (nrf5340)[3D]), GNNS-RST (in, see Digital_Watch[2C], MCU (nrf5340)[3D]), GNNS-TMP (out, see Digital_Watch[2C], MCU (nrf5340)[3D]), SCL_HV (in, see Digital_Watch[3C], Level Shifter (PCA9306JKZ)[3B]), SDA_HV (bidir, see Digital_Watch[3C], Level Shifter (PCA9306JKZ)[3B]), VOUTLDO1 (in, see Digital_Watch[2C], PMIC (nPM1300)[3C])

### Nets
GND: C601.2 C602.1 C603.1 C604.1 MD601.1(GND) MD601.4(GND) MD601.5(GND) MD601.6(GND) MD601.10(GND) MD601.11(GND) MD601.15(GND) MD601.16(GND) MD601.20(GND)
3.0 V: C601.1 C602.2 C604.2 MD601.2(V_IO) MD601.17(VCC) R601.1 R602.1 ; port 3.0 V
GNNS-INT: MD601.19(EXTINT) ; port GNNS-INT
GNNS-RST: MD601.18(~{RESET}) ; port GNNS-RST
GNNS-TMP: MD601.7(TIMEPULSE) ; port GNNS-TMP
SCL_HV: MD601.12(SCL) R602.2 ; port SCL_HV
SDA_HV: MD601.9(SDA) R601.2 ; port SDA_HV
VOUTLDO1: C603.2 MD601.3(V_BCKP) ; port VOUTLDO1

Not connected (* = marked no-connect by the designer): MD601 8(~{SAFEBOOT})* 13(TXD)* 14(RXD)*

### Library data of the parts
C601 = CMP-2006-02520-2: as C104 on sheet PMIC (nPM1300); Tolerance: 20%; Resistor Type: Ceramic; Voltage: 25V; Max Operating Temperature: 85°C; Min Operating Temperature: -55°C; Capacitance: 10uF; Dielectric: X5R; Lead Free: Lead Free; REACH SVHC: No SVHC; Case/Package: 0603; Mount: Surface Mount; Voltage Rating (DC): 25V; Height: 0.8mm; Length: 1.6mm; Thickness: 0.031inch; Width: 0.031inch; Termination: SMD/SMT; Case Code (Imperial): 0603; Case Code (Metric): 1608; Package Quantity: 1; Packaging: Tape and Reel; Depth: 0.8mm; Voltage Rating: 25V; Weight: 0.000222oz; Number of Pins: 2
C602-C604 = C0201-100n-16V-X7S: Capacitor, X7S, ±10%; Pad Count: 2; Value: 100nF; Footprint Doc: 0201; Component Class: Capacitors; Author: rsk
MD601 = CMP-207130-000027-1: M10 GNSS LGA PATCH ANTENNA MOD
R601 R602 = R0201-10k: Resistor, ±1%, 0.05W; Manufacturer: N.A.; Part number IPS: 00000001255; Part number Norautron: 26107101; Part number NEMS: 100100065; Pad Count: 2; Value: 10k; Note: Chip Res 1%; Component Status: Active; Part Number: R0201-10k; PartId: 100100065; Component Class: Resistors; Author: rsk; Manufacturer Part Number: N.A.; ComponentLink1URL: N.A.; ComponentLink1Description: Datasheet; ComponentLink2URL: N.A.; ComponentLink2Description: Supplier link; HelpURL: N.A.; Footprint Doc: 0201; LatestRevisionDate: 2014-11-13; Published: 2014-11-13; Supplier 1: N.A.; Supplier Part Number 1: N.A.; Supplier 2: N.A.; Supplier Part Number 2: N.A.; Artikkelnr Noca: N.A.

## Sheet PPG (MAX30102).SchDoc
size A; SheetNumber: 7; SheetTotal: 9
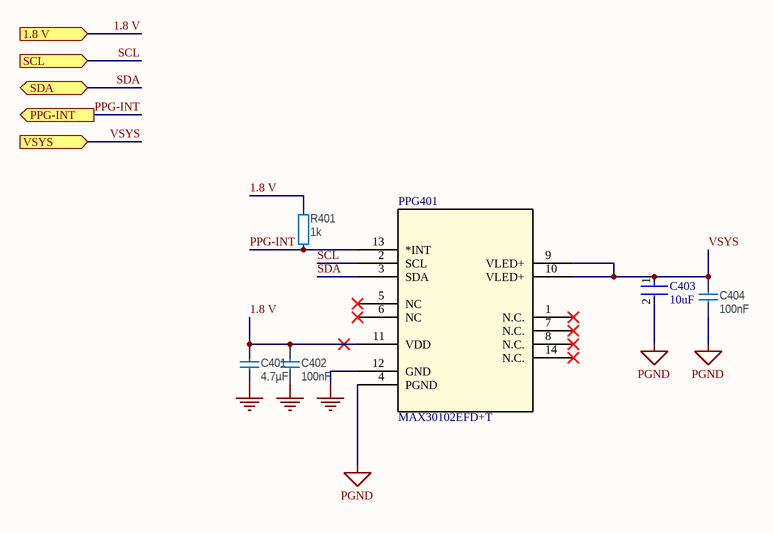
[diagram p6: PPG (MAX30102).SchDoc]

### Parts
C401  4.7µF  [CAPC1608X06L]
C402  100nF  [CAPC0603X03L_C]
C403  10uF  [FP-GRM188-0_2-MFG]
C404  100nF  [CAPC0603X03L_C]
PPG401  MAX30102EFD+T  [21-1048_F143A5+1_MXM]
R401  1k  [RESC0603X03L_C]

### Ports
1.8 V (in, see Digital_Watch[1C], IMU (BMI270)[1A], Level Shifter (PCA9306JKZ)[2B], PMIC (nPM1300)[3B]), PPG-INT (out, see Digital_Watch[1C], MCU (nrf5340)[3D]), SCL (in, see Digital_Watch[1C], IMU (BMI270)[1A], Level Shifter (PCA9306JKZ)[2B], MCU (nrf5340)[4C], PMIC (nPM1300)[2C]), SDA (bidir, see Digital_Watch[1C], IMU (BMI270)[1B], Level Shifter (PCA9306JKZ)[2B], MCU (nrf5340)[4C], PMIC (nPM1300)[2C]), VSYS (in, see Digital_Watch[1C], PMIC (nPM1300)[3B])

### Nets
GND: C401.1 C402.1 PPG401.12(GND)
PGND: C403.2 C404.1 PPG401.4(PGND)
1.8 V: C401.2 C402.2 PPG401.11(VDD) R401.2 ; port 1.8 V
PPG-INT: PPG401.13(*INT) R401.1 ; port PPG-INT  [project net P0.22]
SCL: PPG401.2(SCL) ; port SCL  [project net P1.03/TWI]
SDA: PPG401.3(SDA) ; port SDA  [project net P1.02/TWI]
VSYS: C403.1 C404.2 PPG401.9(VLED+) PPG401.10(VLED+) ; port VSYS

Not connected (* = marked no-connect by the designer): PPG401 1(N.C.)* 5(NC)* 6(NC)* 7(N.C.)* 8(N.C.)* 14(N.C.)*

### Library data of the parts
C401 = C0603-4µ7-10V-X7S: Capacitor, X7S, ±10%; Pad Count: 2; Value: 4.7µF; Footprint Doc: 0603; Component Class: Capacitors; Author: rsk
C402 C404 = C0201-100n-16V-X7S: Capacitor, X7S, ±10%; Pad Count: 2; Value: 100nF; Footprint Doc: 0201; Component Class: Capacitors; Author: rsk
C403 = CMP-2006-02520-2: as C104 on sheet PMIC (nPM1300); Tolerance: 20%; Resistor Type: Ceramic; Voltage: 25V; Max Operating Temperature: 85°C; Min Operating Temperature: -55°C; Capacitance: 10uF; Dielectric: X5R; Lead Free: Lead Free; REACH SVHC: No SVHC; Case/Package: 0603; Mount: Surface Mount; Voltage Rating (DC): 25V; Height: 0.8mm; Length: 1.6mm; Thickness: 0.031inch; Width: 0.031inch; Termination: SMD/SMT; Case Code (Imperial): 0603; Case Code (Metric): 1608; Package Quantity: 1; Packaging: Tape and Reel; Depth: 0.8mm; Voltage Rating: 25V; Weight: 0.000222oz; Number of Pins: 2
PPG401 = MAX30102EFD+T: High-Sensitivity Pulse Oximeter and Heart-Rate Sensor for Wearable Health; Manufacturer: Analog Devices; Manufacturer Lifecycle Status: PRODUCTION; Supplier: Newark; Supplier Part Number: MAX30102EFD+T; Manufacturer Part Number: MAX30102EFD+T; RoHS: Compliant; Category: Sensors; Stock: 3293; Pricing: 1=14.08, 10=11.09, 25=10.35, 50=10.07, 100=9.81 (USD); Lifecycle Status: Production; Max Operating Temperature: 85°C; Min Operating Temperature: -40°C; Pins: 14; ComponentLink1URL: https://datasheet.octopart.com:443/MAX30102EFD%2BT-Analog-Devices-datasheet-138896825.pdf?src-supplier=Newark; ComponentLink1Description: https://datasheet.octopart.com:443/MAX30102EFD%2BT-Analog-Devices-datasheet-138896825.pdf?src-supplier=Newark; ComponentLink2URL: https://octopart.com:443/opatz8j6/c1?t=lNLdbXEB-8Tfy8yyi4Ep1fg7LQBHMOUji7viRAxOBTnstiUziOP12QkdXpxsJz2gTCdMLFd-o1sQhiq2QGCXJAw1OXoBq43W6EvqANHznVSVXZIvjcOQ14Y9w58vDVvxUyf5yLP6ooKDBR_TMbQokFu0a_69z_GhI_gBgFQO_qOVaRFVU7xfxZqeajADuRKWlhE-FhNjkerkGbayOHC05gfclkqna1nR66NbwE0W05Kd5w-3rkyZdBWpea1K5kTkzC5cc6dy1LvAz2CYcaBGdRuMedz6_0DBNqLseYE7_4nUa2FvBnotLbJr&src-supplier=Analog+Devices; ComponentLink2Description: https://octopart.com:443/opatz8j6/c1?t=lNLdbXEB-8Tfy8yyi4Ep1fg7LQBHMOUji7viRAxOBTnstiUziOP12QkdXpxsJz2gTCdMLFd-o1sQhiq2QGCXJAw1OXoBq43W6EvqANHznVSVXZIvjcOQ14Y9w58vDVvxUyf5yLP6ooKDBR_TMbQokFu0a_69z_GhI_gBgFQO_qOVaRFVU7xfxZqeajADuRKWlhE-FhNjkerkGbayOHC05gfclkqna1nR66NbwE0W05Kd5w-3rkyZdBWpea1K5kTkzC5cc6dy1LvAz2CYcaBGdRuMedz6_0DBNqLseYE7_4nUa2FvBnotLbJr&src-supplier=Analog+Devices; ComponentLink3URL: https://sigma.octopart.com:443/140085706/technical_drawing/Maxim-Integrated-MAX30102EFD%2BT.pdf?src-supplier=ShanghaiCT; ComponentLink3Description: https://sigma.octopart.com:443/140085706/technical_drawing/Maxim-Integrated-MAX30102EFD%2BT.pdf?src-supplier=ShanghaiCT; ComponentLink4URL: https://datasheet.octopart.com:443/MAX30102EFD%2BT-Maxim-Integrated-datasheet-65703272.pdf?src-supplier=Future+Electronics; ComponentLink4Description: https://datasheet.octopart.com:443/MAX30102EFD%2BT-Maxim-Integrated-datasheet-65703272.pdf?src-supplier=Future+Electronics; ComponentLink5URL: http://sigma.octopart.com:80/conflict_mineral_statement/Analog-Devices-company-33.pdf?src-supplier=Compliance+Statements; ComponentLink5Description: http://sigma.octopart.com:80/conflict_mineral_statement/Analog-Devices-company-33.pdf?src-supplier=Compliance+Statements; ComponentLink6URL: http://sigma.octopart.com:80/reach_statement/Maxim-Integrated-company-67.pdf?src-supplier=Compliance+Statements; ComponentLink6Description: http://sigma.octopart.com:80/reach_statement/Maxim-Integrated-company-67.pdf?src-supplier=Compliance+Statements; ComponentLink7URL: http://sigma.octopart.com:80/rohs_statement/Maxim-Integrated-company-66.pdf?src-supplier=Compliance+Statements; ComponentLink7Description: http://sigma.octopart.com:80/rohs_statement/Maxim-Integrated-company-66.pdf?src-supplier=Compliance+Statements; ComponentLink8URL: http://sigma.octopart.com:80/conflict_mineral_statement/Maxim-Integrated-company-65.pdf?src-supplier=Compliance+Statements; ComponentLink8Description: http://sigma.octopart.com:80/conflict_mineral_statement/Maxim-Integrated-company-65.pdf?src-supplier=Compliance+Statements; ComponentLink9URL: https://octopart.com:443/opatz8j6/c1?t=GsCt6aUpOQZgLTAwy0RBe6VsdHe-YM9CHSfZbpG2BIHTLL6za4yMq7SeTLKgtsalxQzcPM4gwltrYJQATWSkjq-ZOauWDS99dmEtuyDrm5CMyiSwn4YVYgrc5-8zEVaZQwsVrbhWgf4IihAwKWxSwuC3IuAlEmd_BDG_ezWI42kw2SprHEToFG0VN0FjC_hwMAdTZF1mnz1-AXLMt1O2U-REnbHhwnY4I5_cRgWL3NsbmJbHfrYGaigF3NkWMAVHGLmDUv6I_DszeMkKCRV1y439GhWoj1xfZe8LgWUXVUrh8MonsIarQGZ5&src-supplier=Compliance+Statements; ComponentLink9Description: https://octopart.com:443/opatz8j6/c1?t=GsCt6aUpOQZgLTAwy0RBe6VsdHe-YM9CHSfZbpG2BIHTLL6za4yMq7SeTLKgtsalxQzcPM4gwltrYJQATWSkjq-ZOauWDS99dmEtuyDrm5CMyiSwn4YVYgrc5-8zEVaZQwsVrbhWgf4IihAwKWxSwuC3IuAlEmd_BDG_ezWI42kw2SprHEToFG0VN0FjC_hwMAdTZF1mnz1-AXLMt1O2U-REnbHhwnY4I5_cRgWL3NsbmJbHfrYGaigF3NkWMAVHGLmDUv6I_DszeMkKCRV1y439GhWoj1xfZe8LgWUXVUrh8MonsIarQGZ5&src-supplier=Compliance+Statements
R401 = R0201: Resistor, ±1%, 0.05W; Pad Count: 2; Footprint Doc: 0201; Value: 1k; Component Class: Resistors; Author: rsk

## Sheet Level Shifter (PCA9306JKZ).SchDoc
size A; SheetNumber: 8; SheetTotal: 9
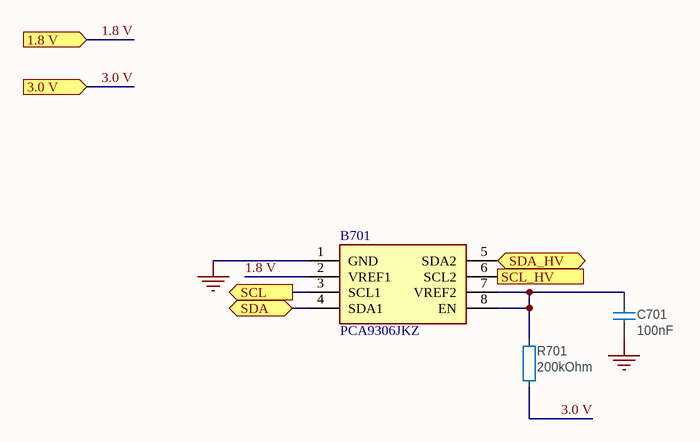
[diagram p7: Level Shifter (PCA9306JKZ).SchDoc]

### Parts
B701  PCA9306JKZ  [PCA9306JKZ]
C701  100nF  [CAPC0603X03L_C]
R701  200kOhm  [RESC0603X03L_C]

### Ports
1.8 V (in, see Digital_Watch[3C], IMU (BMI270)[1A], PMIC (nPM1300)[3B], PPG (MAX30102)[1A]), 3.0 V (in, see Digital_Watch[3C], GNNS (SAM-M10Q-00B)[1A], MCU (nrf5340)[2A], PMIC (nPM1300)[3B]), SCL (out, see Digital_Watch[3C], IMU (BMI270)[1A], MCU (nrf5340)[4C], PMIC (nPM1300)[2C], PPG (MAX30102)[1A]), SCL_HV (out, see Digital_Watch[3C], GNNS (SAM-M10Q-00B)[1A]), SDA (bidir, see Digital_Watch[3C], IMU (BMI270)[1B], MCU (nrf5340)[4C], PMIC (nPM1300)[2C], PPG (MAX30102)[1A]), SDA_HV (bidir, see Digital_Watch[3C], GNNS (SAM-M10Q-00B)[1A])

### Nets
GND: B701.1(GND) C701.1
1.8 V: B701.2(VREF1) ; port 1.8 V
3.0 V: R701.1 ; port 3.0 V
P1.02/TWI: B701.4(SDA1) ; port SDA
P1.03/TWI: B701.3(SCL1) ; port SCL
SCL_HV: B701.6(SCL2) ; port SCL_HV
SDA_HV: B701.5(SDA2) ; port SDA_HV
NetB701_7: B701.7(VREF2) B701.8(EN) C701.2 R701.2

### Library data of the parts
B701 = PCA9306JKZ: Dual Supply bidirectional I2C-bus and SMBus voltage-level translator; Manufacturer: NXP Semiconductors; Max Supply Voltage: 3.6V; Min Supply Voltage: 0V; Nominal Supply Voltage (DC): 1.2V; Number of Bits: 1; Propagation Delay: 3.3ns; Supplier: Arrow Electronics; Supplier Part Number: PCA9306JKZ; Manufacturer Part Number: PCA9306JKZ; RoHS: Compliant; Category: Voltage Level Shifters; Stock: 18000; Pricing: 6000=0.3053, 12000=0.2988, 18000=0.2948 (USD); China RoHS: Compliant; Height - Seated (Max): 500µm; Length: 1.35mm; Lifecycle Status: Production; Max Operating Temperature: 105°C; Min Operating Temperature: -40°C; Number of Circuits: 1; Number of Terminals: 8; REACH SVHC: Yes; Terminal Pitch: 350µm; Width: 1mm; ComponentLink1URL: https://datasheet.octopart.com:443/PCA9306JKZ-NXP-Semiconductors-datasheet-180940845.pdf?src-supplier=IHS; ComponentLink1Description: https://datasheet.octopart.com:443/PCA9306JKZ-NXP-Semiconductors-datasheet-180940845.pdf?src-supplier=IHS; ComponentLink2URL: https://datasheet.octopart.com:443/PCA9306JKZ-NXP-Semiconductors-datasheet-24570114.pdf?src-supplier=Future+Electronics; ComponentLink2Description: https://datasheet.octopart.com:443/PCA9306JKZ-NXP-Semiconductors-datasheet-24570114.pdf?src-supplier=Future+Electronics; ComponentLink3URL: http://sigma.octopart.com:80/reach_statement/NXP-Semiconductors-company-13.pdf?src-supplier=Compliance+Statements; ComponentLink3Description: http://sigma.octopart.com:80/reach_statement/NXP-Semiconductors-company-13.pdf?src-supplier=Compliance+Statements; ComponentLink4URL: http://sigma.octopart.com:80/rohs_statement/NXP-Semiconductors-company-12.pdf?src-supplier=Compliance+Statements; ComponentLink4Description: http://sigma.octopart.com:80/rohs_statement/NXP-Semiconductors-company-12.pdf?src-supplier=Compliance+Statements; Supplier 1: DigiKey; Supplier Part Number 1: 568-PCA9306JKZCT-ND
C701 = C0201-100n-16V-X7S: Capacitor, X7S, ±10%; Pad Count: 2; Value: 100nF; Footprint Doc: 0201; Component Class: Capacitors; Author: rsk
R701 = R0201-2R2: Resistor, ±1%, 0.05W; Value: 2R2; Pad Count: 2; Footprint Doc: 0201; Component Class: Resistors; Author: rsk

## Nets that join several sheets
GND: MCU (nrf5340) (29 pins), PMIC (nPM1300) (14 pins), USB-C (6 pins), IMU (BMI270) (5 pins), GNNS (SAM-M10Q-00B) (13 pins), PPG (MAX30102) (C401.1 C402.1 PPG401.12), Level Shifter (PCA9306JKZ) (B701.1 C701.1)
1.8 V: PMIC (nPM1300) (7 pins), IMU (BMI270) (5 pins), PPG (MAX30102) (C401.2 C402.2 PPG401.11 R401.2), Level Shifter (PCA9306JKZ) (B701.2)
3.0 V: MCU (nrf5340) (28 pins), PMIC (nPM1300) (C109.1 L102.1 U101.32), GNNS (SAM-M10Q-00B) (7 pins), Level Shifter (PCA9306JKZ) (R701.1)
CC1: PMIC (nPM1300) (U101.23), USB-C (J001.A5)
CC2: PMIC (nPM1300) (U101.24), USB-C (J001.B5)
D_N: MCU (nrf5340) (U201.B4), USB-C (D001.4)
D_P: MCU (nrf5340) (U201.B2), USB-C (D001.6)
GNNS-INT: MCU (nrf5340) (U201.AK16), GNNS (SAM-M10Q-00B) (MD601.19)
GNNS-RST: MCU (nrf5340) (U201.AL13), GNNS (SAM-M10Q-00B) (MD601.18)
GNNS-TMP: MCU (nrf5340) (U201.AL15), GNNS (SAM-M10Q-00B) (MD601.7)
GPIO4: MCU (nrf5340) (U201.R31), PMIC (nPM1300) (U101.11)
IMU-INT: MCU (nrf5340) (U201.AB2), IMU (BMI270) (IMU501.9)
NetC001_1: PMIC (nPM1300) (C101.1 U101.21), USB-C (6 pins)
P0.22: MCU (nrf5340) (U201.AK18), PPG (MAX30102) (PPG401.13 R401.1)
P1.02/TWI: MCU (nrf5340) (U201.AE1), PMIC (nPM1300) (R104.1 U101.13), IMU (BMI270) (IMU501.14), PPG (MAX30102) (PPG401.3), Level Shifter (PCA9306JKZ) (B701.4)
P1.03/TWI: MCU (nrf5340) (U201.AF2), PMIC (nPM1300) (R103.1 U101.14), IMU (BMI270) (IMU501.13), PPG (MAX30102) (PPG401.2), Level Shifter (PCA9306JKZ) (B701.3)
SCL_HV: GNNS (SAM-M10Q-00B) (MD601.12 R602.2), Level Shifter (PCA9306JKZ) (B701.6)
SDA_HV: GNNS (SAM-M10Q-00B) (MD601.9 R601.2), Level Shifter (PCA9306JKZ) (B701.5)
VBUS_OUT: MCU (nrf5340) (R201.1), PMIC (nPM1300) (C107.1 U101.22)
VOUTLDO1: PMIC (nPM1300) (C110.1 C111.1 U101.29), GNNS (SAM-M10Q-00B) (C603.2 MD601.3)
VSYS: PMIC (nPM1300) (6 pins), PPG (MAX30102) (C403.1 C404.2 PPG401.9 PPG401.10)